# EAGLE design YOTSUBA_-Y-Z_ver.1.4 (EAGLE 9.6.2)
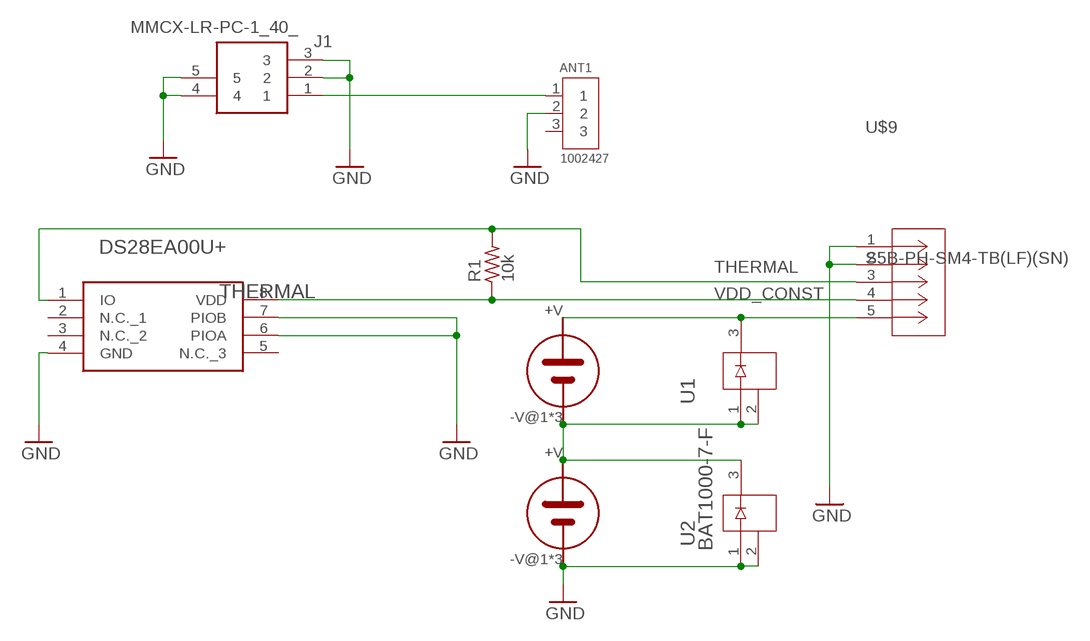
[diagram p0: schematic, sheet 1]

## Parts
ANT1  1002427  [ANTENNA_1002427]
J1  MMCX-LR-PC-1_40_  [MMCXLRPC140]
R1  10k  R-US_R0805  [R0805]
THERMAL  DS28EA00U+  [SOP65P490X110-8N]
U1  BAT1000-7-F  [SOT23_BAT_DIO]
U2  BAT1000-7-F  [SOT23_BAT_DIO]
U$2  3G30A  [SOLAR_3G30A]
U$3  3G30A  [SOLAR_3G30A]
U$9  S5B-PH-SM4-TB(LF)(SN)  [CONN_S5B-PH-SM4-TB_JST]

## Nets
GND [GND]: ANT1.2 J1.2 J1.3 J1.4 J1.5 THERMAL.4(GND) THERMAL.6(PIOA) THERMAL.7(PIOB) U2.1 U2.2 U$3.-V@1(-V) U$3.-V@2(-V) U$3.-V@3(-V) U$9.1 U$9.2
N$5: U1.1 U1.2 U2.3 U$2.-V@1(-V) U$2.-V@2(-V) U$2.-V@3(-V) U$3.+V
N$6: U1.3 U$2.+V U$9.5
RF2 [ANTENNA]: ANT1.1 J1.1
THERMAL: R1.2 THERMAL.1(IO) U$9.3
VDD_CONST: R1.1 THERMAL.8(VDD) U$9.4
Unconnected: ANT1.3 THERMAL.2(N.C._1) THERMAL.3(N.C._2) THERMAL.5(N.C._3)

## Library data of the parts
ANT1 = 1002427:1002427: RF ANT 868MHZ/915MHZ STAMPED MET; DESCRIPTION: 868MHz, 915MHz, 1.575GHz Beidou, GLONASS, GPS, ISM, LoRa, LPWAN, Sigfox Stamped Metal RF Antenna 868MHz, 915MHz, 1.561GHz ~ 1.602GHz 3dBi Solder Surface Mount; DIGI-KEY_PART_NUMBER: 478-1002427TR-ND; MF: Ethertronics/AVX; MP: 1002427; PACKAGE: None; PURCHASE-URL: https://pricing.snapeda.com/search/part/1002427/?ref=eda
J1 = MMCX-LR-PC-1_40_:MMCX-LR-PC-1_40_: RF Connectors / Coaxial Connectors MINI PUSH-ON CONN RECEPT RA Source: Datasheet <https://componentsearchengine.com/Datasheets/1/MMCX-LR-PC-1(40).pdf>; DESCRIPTION: RF Connectors / Coaxial Connectors MINI PUSH-ON CONN RECEPT RA; HEIGHT: 3.95mm; MANUFACTURER_NAME: Hirose; MANUFACTURER_PART_NUMBER: MMCX-LR-PC-1(40); MOUSER_PART_NUMBER: 798-MMCX-LR-PC-1(40); MOUSER_PRICE-STOCK: https://www.mouser.co.uk/ProductDetail/Hirose-Connector/MMCX-LR-PC-140?qs=XQjbzJWzFPVvtPijmLd%2FXQ%3D%3D
R1 = rcl:R-US_: RESISTOR, American symbol; SPICEPREFIX: R
THERMAL = DS28EA00U+:DS28EA00U+: Maxim DS28EA00U+ Temperature Sensor 8-Pin uMAX, -40 +85 C Source: Datasheet <https://datasheets.maximintegrated.com/en/ds/DS28EA00.pdf>; ARROW_PART_NUMBER: DS28EA00U+; ARROW_PRICE-STOCK: https://www.arrow.com/en/products/ds28ea00u/maxim-integrated?region=nac; DESCRIPTION: Maxim DS28EA00U+ Temperature Sensor 8-Pin uMAX, -40 +85 C; HEIGHT: 1.1mm; MANUFACTURER_NAME: Analog Devices; MANUFACTURER_PART_NUMBER: DS28EA00U+; MOUSER_PART_NUMBER: 700-DS28EA00U; MOUSER_PRICE-STOCK: https://www.mouser.co.uk/ProductDetail/Maxim-Integrated/DS28EA00U%2b?qs=7H2Jq%252ByxpJJHHt%2F9DIHuNA%3D%3D
U1 U2 = BAT1000:BAT1000-7-F; COPYRIGHT: Copyright (C) 2023 Ultra Librarian. All rights reserved.; DIGIKEY_PART_NUMBER_1: BAT1000-7FDITR-ND; DIGIKEY_PART_NUMBER_2: BAT1000-7FDICT-ND; DIGIKEY_PART_NUMBER_3: BAT1000-7FDIDKR-ND; MANUFACTURER_PART_NUMBER: BAT1000-7-F; MFR_NAME: Diodes Inc
U$2 U$3 = 3G30A_normal:3G30A
U$9 = S5B-PH-SM4:S5B-PH-SM4-TB(LF)(SN); COPYRIGHT: Copyright (C) 2023 Ultra Librarian. All rights reserved.; DIGIKEY_PART_NUMBER_1: 455-1752-2-ND; DIGIKEY_PART_NUMBER_2: 455-1752-1-ND; DIGIKEY_PART_NUMBER_3: 455-1752-6-ND; MANUFACTURER_PART_NUMBER: S5B-PH-SM4-TB(LF)(SN); MFR_NAME: JST

## Net classes
2 GND: clearance 0.5 mm to class 0, clearance 0.21 mm to class 1, clearance 0.5 mm

## Board
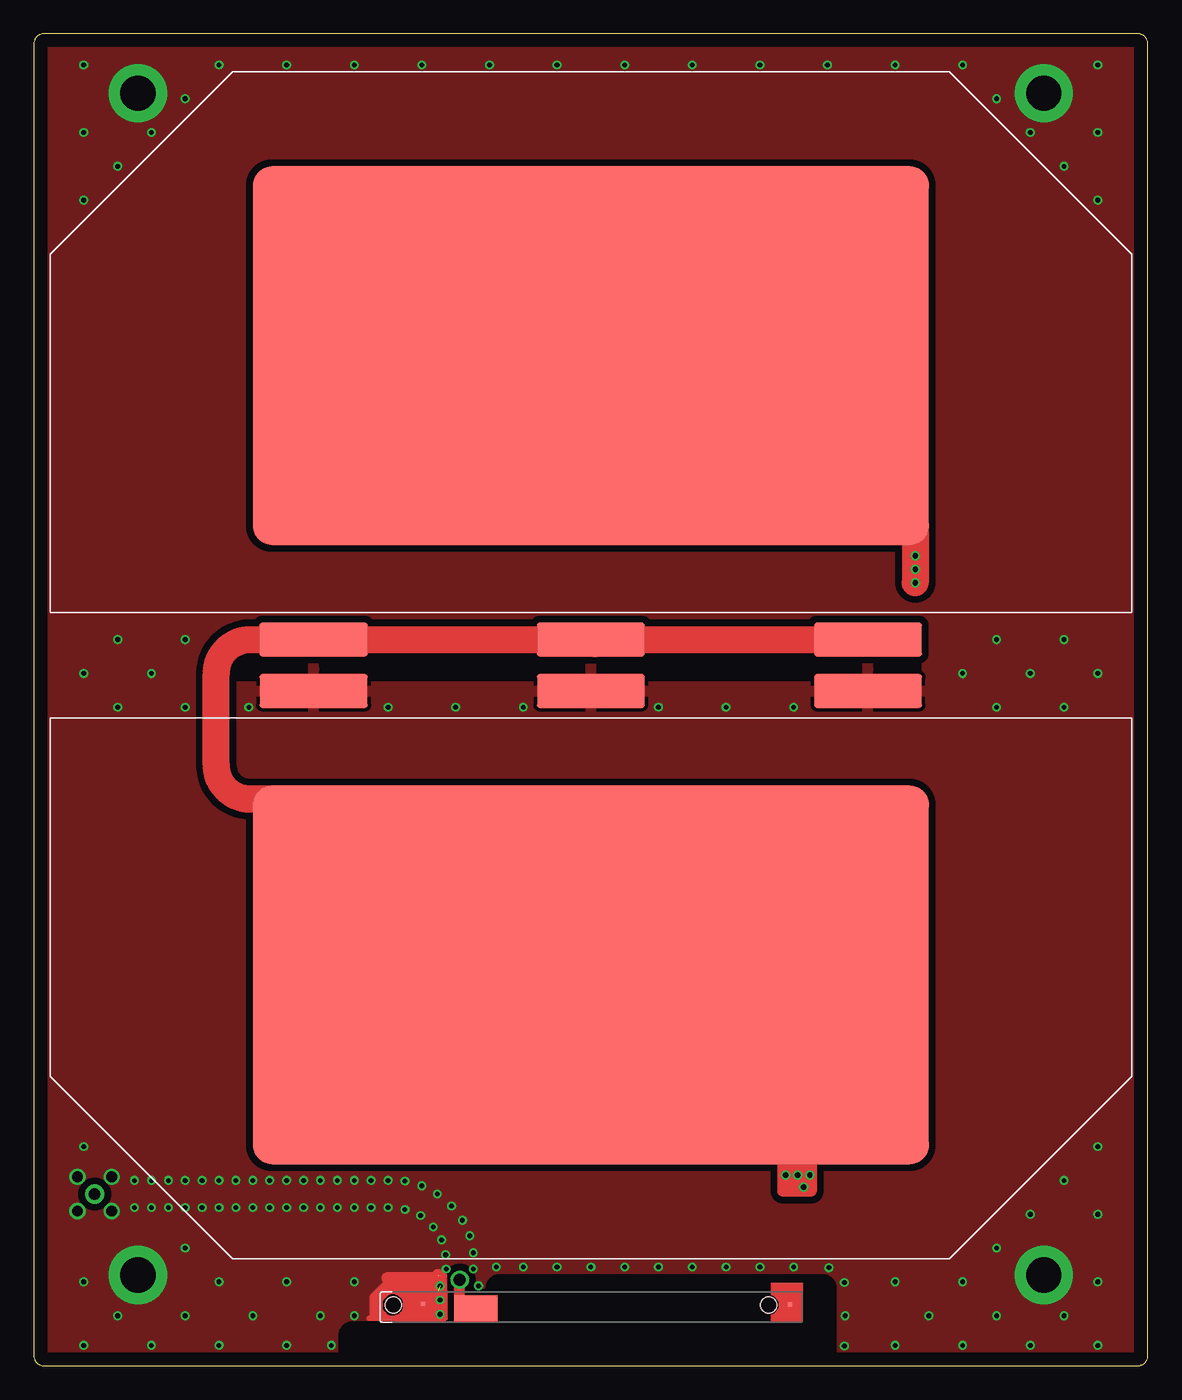
[diagram p1: board, top side]
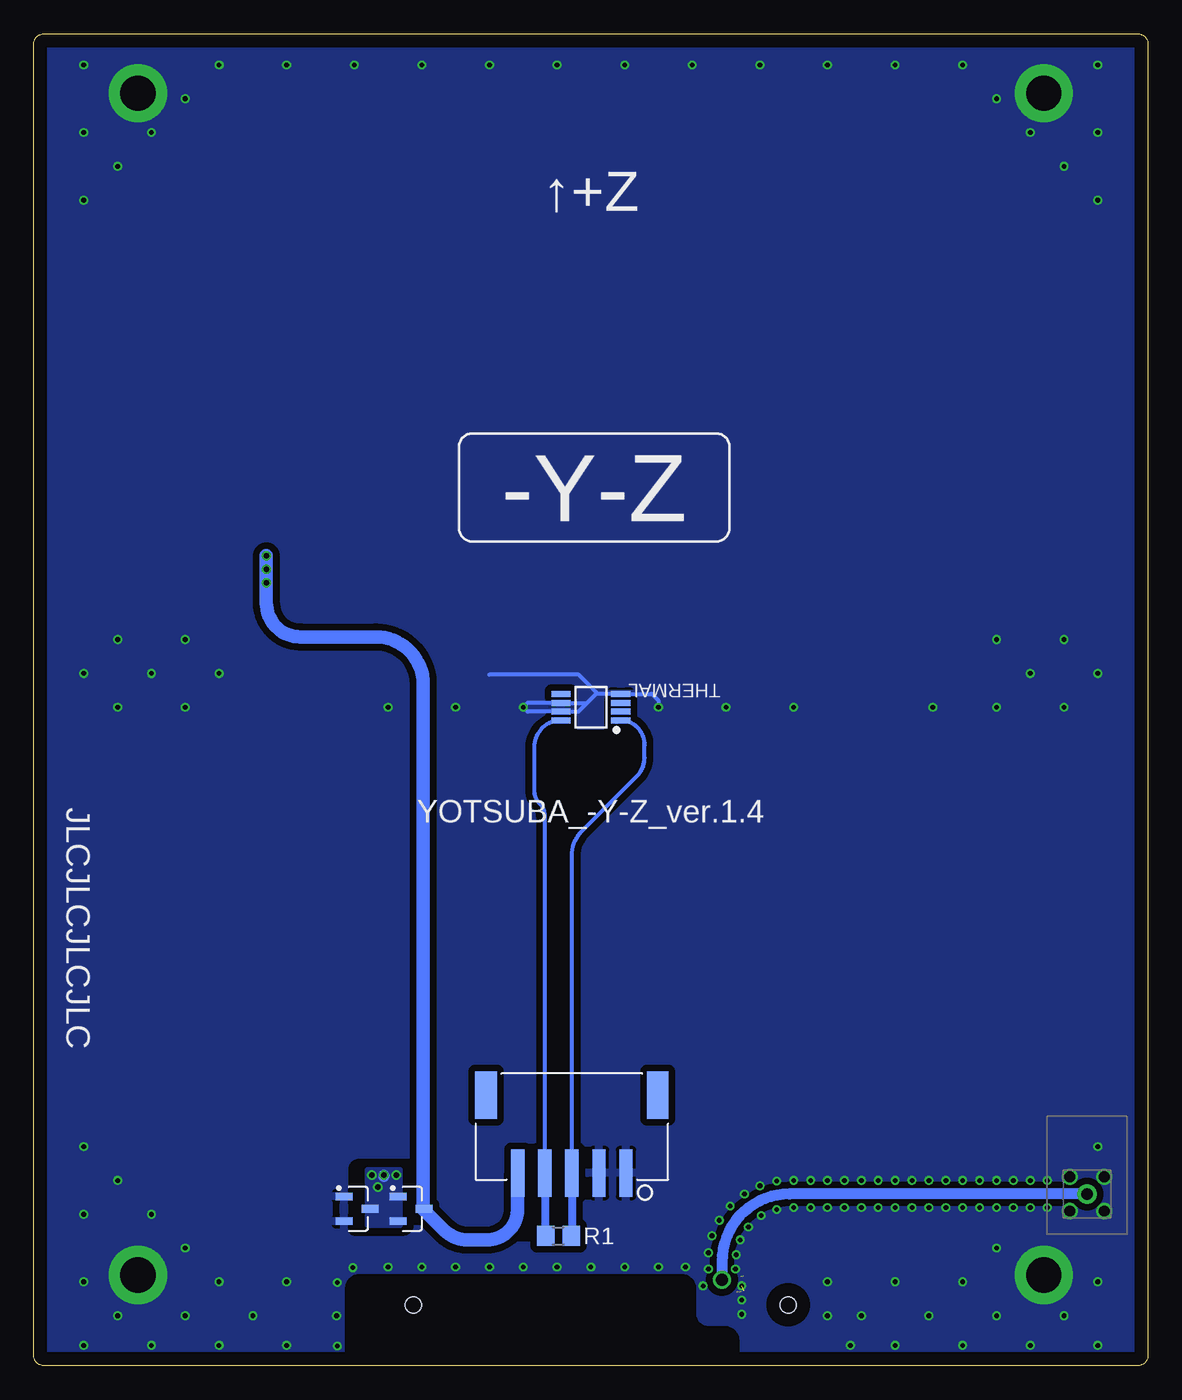
[diagram p2: board, bottom side, seen from below]

Size 82.4 x 98.5 mm. Coordinates in mm from the lower left corner, seen from the top.
Outline: 0,97.75 0,0.75 arc90 0.75,0 81.65,0 arc90 82.4,0.75 82.4,97.75 arc90 81.65,98.5 0.75,98.5 arc90 0,97.75
Copper layers (1*16): Top 0.035mm / dielectric 1.53mm / Bottom 0.035mm
Design rules "pban_5mil-l2 *": minimum track width 5mil, minimum drill 0.3mm, track to track 5mil, track to pad 0.229mm, pad to pad 5mil, via to via 5mil, smd to smd 5mil, copper to edge 1mm, drill to drill 0.5mm, minimum pad ring 0.15mm, minimum via ring 0.15mm, stop-mask expansion 4mil, vias tented up to drill 0.35mm, thermal gap 10mil
tRestrict: 12 lines
bRestrict: 21 lines

### Footprints (pad centres in the part's own frame; a part is rotated, then mirrored left to right if it is on the bottom)
ANTENNA_1002427 = smd 3.2 x 1.9: 1 24.1,-1.05 | smd 0.3 x 0.3: 2 28.02,-1.375; 3 0.875,-1.325 | hole 1.2: 2.46,-1.3; 30.2,-1.3
MMCXLRPC140 = drill 0.85 pad 1.422: 1 0,0 | drill 0.8: 2 -1.27,-1.27; 3 1.27,-1.27; 4 1.27,1.27; 5 -1.27,1.27
R0805 = smd 1.3 x 1.5: 1 -0.95,0; 2 0.95,0
SOP65P490X110-8N = smd 1.425 x 0.45: 1 -2.212,0.975; 2 -2.212,0.325; 3 -2.212,-0.325; 4 -2.212,-0.975; 5 2.212,-0.975; 6 2.212,-0.325; 7 2.212,0.325; 8 2.212,0.975
SOT23_BAT_DIO = smd 0.568 x 1.259: 1 -0.915,-0.965; 2 0.915,-0.965; 3 0,0.965
SOLAR_3G30A = smd 50 x 28: +V 0,19 | smd 8 x 2.5: -V@1 -20.5,-2; -V@2 20.5,-2; -V@3 0,-2
CONN_S5B-PH-SM4-TB_JST = smd 0.991 x 3.505: 1 4,-3.453; 2 2,-3.453; 3 0,-3.453; 4 -2,-3.453; 5 -4,-3.453 | smd 1.6 x 3.505: 6 -6.35,2.297; 7 6.35,2.297

### Placement (x,y rotation side)
ANT1  56.8,3.2 180 top
J1  4.5,12.7 90 bottom
R1  43.6,9.6 0 bottom
THERMAL  41.2,48.7 180 bottom
U1  54.5,11.6 270 bottom
U2  58.5,11.6 270 bottom
U$2  41.2,55.7 0 top
U$3  41.2,47.9 180 top
U$9  42.6,17.7 0 bottom

### Tracks (layer width: path | path; a pad name or v marks a point on that pad's centre or on a via)
GND  (via drill 0.35, 2.6 pad 4.3)  (3 unrouted)
  Top 0.2: ANT1.2 29.24,3.5
  Top 0.4: 29.24,3.5 24.8,3.5 | 25.3,3.8 25.9,3.8 | 30.4,5.45 30.4,3.5
  Top 0.8: ANT1.2 30,4.58 30,6.5 26.8,6.5 | 26.8,6.5 26.1,6.5 | 26.8,6.5 26.8,5.7 26,5.7
  Top 1: 25.3,5 25.3,3.8 | 29.9,6.65 29.9,5.55 | 30.1,6.6 30.1,5.5
  Top 1.016: 26,5.7 25.3,5
  Bottom 0.3: 48.7,51.1 42.1,51.1 40.75,49.75 | 40.75,49.75 40.67,49.67 THERMAL.4 36.73,49.67 36.7,49.7 36.2,49.2 v36.2,48.7 | 41.5,49 40.75,49.75 | 41.5,49 43.31,49 THERMAL.6 45.88,49.02 v46.2,48.7 45.88,48.38 THERMAL.7 42.12,48.38 41.5,49
  other vias: 34.2,7.3 31.2,48.7 26.2,48.7 15.9,48.7 51.2,48.7 56.2,48.7 71.2,48.7 68.7,51.2 73.7,51.2 78.7,51.2 76.2,48.7 78.7,16.2 76.2,13.7 78.7,11.2 78.7,6.2 73.7,11.2 71.2,8.7 68.7,6.2 63.7,6.2 60,3.7 63.7,1.5 66.2,3.7 71.2,3.7 68.7,1.5 73.7,1.5 76.2,3.7 78.7,1.5 23.7,11.7 21.2,13.7 16.2,13.7 6.2,48.7 11.2,48.7 8.7,51.2 3.7,51.2 6.2,53.7 11.2,53.7 71.2,53.7 76.2,53.7 3.7,86.2 6.2,88.7 3.7,91.2 3.7,96.2 8.7,91.2 11.2,93.7 13.7,96.2 18.7,96.2 23.7,96.2 28.7,96.2 33.7,96.2 38.7,96.2 43.7,96.2 48.7,96.2 53.7,96.2 58.7,96.2 63.7,96.2 68.7,96.2 71.2,93.7 73.7,91.2 76.2,88.7 78.7,86.2 78.7,91.2 78.7,96.2 18.7,1.5 13.7,1.5 8.7,1.5 11.2,3.7 6.2,3.7 3.7,1.5 3.7,6.2 30.05,3.8 11.2,13.7 7.7,6.7 3.7,16.2 13.7,13.7 12.45,13.7 14.95,13.7 9.95,13.7 8.7,13.7 7.45,13.7 17.45,13.7 18.7,13.7 19.95,13.7 22.45,13.7 23.7,13.7 22.45,11.7 21.2,11.7 19.95,11.7 18.7,11.7 17.45,11.7 16.2,11.7 14.95,11.7 13.7,11.7 12.45,11.7 11.2,11.7 9.95,11.7 8.7,11.7 7.45,11.7 16.2,3.7 21.2,3.7 18.7,6.2 13.7,6.2 11.2,8.7 23.7,6.2 36.2,7.3 41.2,7.3 46.2,7.3 51.2,7.3 56.2,7.3 59.95,1.45 59.95,6.15 23.7,3.7 22,1.5 30.05,4.85 32.9,5.9 24.95,13.7 24.95,11.7 26.2,11.7 26.2,13.7 38.7,7.3 43.7,7.3 48.7,7.3 53.7,7.3 58.8,7.25 27.45,13.65 28.7,13.3 27.45,11.55 28.6,11.1 29.55,10.25 30.15,9.3 30.45,8.2 29.85,12.7 30.9,11.8 31.7,10.75 32.25,9.6 32.5,8.35 30.5,7.15 32.5,7.15 30.05,5.9 7.7,94.1 74.7,94.1 74.7,6.7
  pour Top: 88.55,102.6 -4.45,102.6 arc90 -4.7,102.35 -4.7,-6.15 arc90 -3.95,-6.9 88.8,-6.9 88.8,102.35 arc90
  pour Bottom: -5,-5.6 -5,103.1 arc-90 -4,104.1 86.2,104.1 arc-90 87.2,103.1 87.2,-5.6 arc-90 86.2,-6.6 -4,-6.6 arc-90
N$5  (via drill 0.4)
  Top 0.8: U$3.+V 57.5,28.9 57.5,12.9 55.4,12.9 55.4,14.4 | 55.4,14.4 55.4,15 57.1,15 57.1,14.4 v57.4,14.1 57.1,13.8 | 56.5,14 55.9,14 55.9,13.1 56.5,13.1 56.5,13.2 | v56.5,14.1 56.5,13.2 | v56.5,14.1 56.5,14.4 55.4,14.4 | v56.5,14.1 56.8,13.8 57.1,13.8 | 57.1,13.8 57.1,13.4 v56.95,13.2 56.5,13.2
  Top 2: U$2.-V@3 41.5,53.4 41.7,53.6 | 41.7,53.6 41.4,53.6 U$2.-V@3 | U$3.+V 21.5,28.9 21.5,41.9 16,41.9 arc-90 13.5,44.4 13.5,51.2 arc-90 16,53.7 U$2.-V@1 41.7,53.7 41.7,53.6 | U$2.-V@3 U$2.-V@2 61.7,53.8
  Bottom 0.8: v56.5,14.1 56.5,14
  other vias: 55.6,14.1
  pour Bottom (no thermals): 55.3,14.5 57.7,14.5 57.7,10.4 55.3,10.4
N$6  (via drill 0.4)
  Top 2: U$2.+V 41.49,74.7 54.2,61.7 65.2,61.7 v65.2,57.9
  Bottom 1: v65.2,59.9 v65.2,58.9 v65.2,57.9 65.2,56.4 arc-90 62.7,53.9 57.1,53.9 arc90 53.6,50.4 53.6,11.6 U1.3 53.53,11.5 52.05,10.01 arc-45 50.33,9.3 48.91,9.3 arc-90 46.61,11.6 46.61,14.24 U$9.5
RF2  (via drill 0.9)
  Top 0.152: ANT1.1 31.5,4.25
  Top 0.8: 31.55,6.35 v31.5,6.35 31.5,4.25 | ANT1.1 32.5,4.25
  Bottom 0.8: J1.1 26.5,12.7 arc-90 31.5,7.7 v31.5,6.35
THERMAL
  Bottom 0.3: U$9.3 42.61,37.75 arc45 41.88,39.52 37.79,43.61 arc-45 37.23,44.97 37.23,45.89 arc-90 THERMAL.1 | 42.61,9.8 R1.2
  Bottom 0.6: U$9.3 42.61,14.24 42.61,9.8
VDD_CONST
  Bottom 0.3: THERMAL.8 THERMAL.8 arc-90 45.4,45.73 45.4,42.53 arc-45 45.02,41.62 44.95,41.55 arc45 44.61,40.72 44.6,40.71 44.6,14.4 U$9.4 | 44.61,9.82 R1.1
  Bottom 0.6: 44.6,14.4 44.6,9.65 R1.1
(copper drawn outside any net)
  shapes: Top circle x1

### Text on the board
bNames: ↑+Z | -Y-Z | YOTSUBA_-Y-Z_ver.1.4 | JLCJLCJLCJLC